# Altium schematic sheet schematic.SchDoc
size A4; SheetNumber: 6; SheetTotal: 29
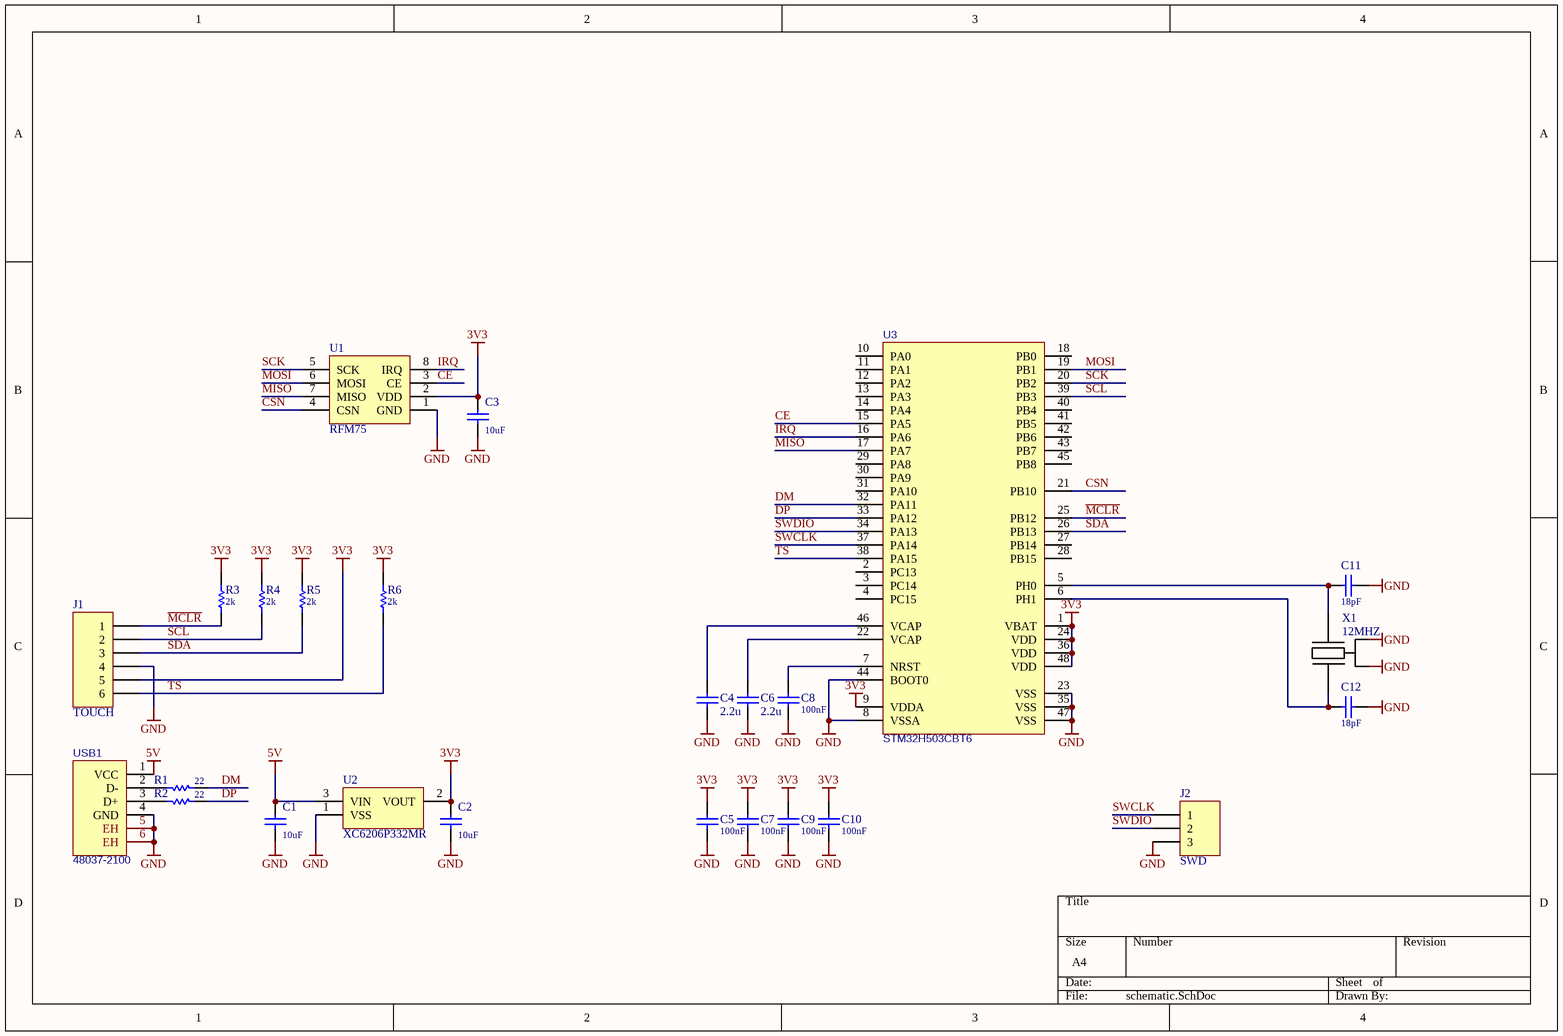
[diagram p0: schematic.SchDoc]

## Parts
C1  10uF  [C0805]
C2  10uF  [C0805]
C3  10uF  [C0805]
C4  2.2u  [C0603]
C5  100nF  [C0402]
C6  2.2u  [C0603]
C7  100nF  [C0402]
C8  100nF  [C0402]
C9  100nF  [C0402]
C10  100nF  [C0402]
C11  18pF  [C0402]
C12  18pF  [C0402]
J1  TOUCH  [HDR-1X6_2.54]  (no BOM)
J2  SWD  [HDR-1x3-P1.25]  (no BOM)
R1  22  [R0603]
R2  22  [R0603]
R3  2k  [R0603]
R4  2k  [R0603]
R5  2k  [R0603]
R6  2k  [R0603]
U1  RFM75  [RFM75]
U2  XC6206P332MR  [SOT-23]
U3  STM32H503CBT6  [LQFP-48]
USB1  48037-2100  [USB-A-TH_480372100]
X1  12MHZ  [CRYSTAL_2.5x2.0mm]

## Nets
3V3: C2.2 C3.2 C5.2 C7.2 C9.2 C10.2 J1.5 R3.2 R4.2 R5.2 R6.2 U1.2(VDD) U2.2(VOUT) U3.1(VBAT) U3.9(VDDA) U3.24(VDD) U3.36(VDD) U3.48(VDD)
5V: C1.2 U2.3(VIN) USB1.1(VCC)
GND: C1.1 C2.1 C3.1 C4.1 C5.1 C6.1 C7.1 C8.1 C9.1 C10.1 C11.1 C12.1 J1.4 J2.3 U1.1(GND) U2.1(VSS) U3.8(VSSA) U3.23(VSS) U3.35(VSS) U3.44(BOOT0) U3.47(VSS) USB1.4(GND) USB1.5(EH) USB1.6(EH) X1.2(GND) X1.4(GND)
CE: U1.3(CE) U3.15(PA5)
CSN: U1.4(CSN) U3.21(PB10)
DM: R1.2 U3.32(PA11)
DP: R2.2 U3.33(PA12)
IRQ: U1.8(IRQ) U3.16(PA6)
~{MCLR}: J1.1 R3.1 U3.25(PB12)
MISO: U1.7(MISO) U3.17(PA7)
MOSI: U1.6(MOSI) U3.19(PB1)
SCK: U1.5(SCK) U3.20(PB2)
SCL: J1.2 R4.1 U3.39(PB3)
SDA: J1.3 R5.1 U3.26(PB13)
SWCLK: J2.1 U3.37(PA14)
SWDIO: J2.2 U3.34(PA13)
~{TS}: J1.6 R6.1 U3.38(PA15)
NetC4_2: C4.2 U3.46(VCAP)
NetC6_2: C6.2 U3.22(VCAP)
NetC8_2: C8.2 U3.7(NRST)
NetC11_2: C11.2 U3.5(PH0) X1.3(X2)
NetC12_2: C12.2 U3.6(PH1) X1.1(X1)
NetR1_1: R1.1 USB1.2(D-)
NetR2_1: R2.1 USB1.3(D+)

Not connected (* = marked no-connect by the designer): U3 2(PC13) 3(PC14) 4(PC15) 10(PA0) 11(PA1) 12(PA2) 13(PA3) 14(PA4) 18(PB0) 27(PB14) 28(PB15) 29(PA8) 30(PA9) 31(PA10) 40(PB4) 41(PB5) 42(PB6) 43(PB7) 45(PB8)

## Library data of the parts
C1-C3 C5 C7-C10 = CAP
C4 C6 = Cap
C11 C12 = CAP: 18pF 50V 0402; P/N: GRM1555C1H180JA01D; LCSC part number: C33149
J1 J2 = Header 3
R1-R6 = RES
U2 = Component_4_1
X1 = CRYSTAL 12MHZ 3.20mm x 2.50mm: CRYSTAL 12MHZ 10PF SMD; P/N: TXM12M0004252FBCEO00T; LCSC part number: C284155
USB1 = 48037-2100: LCSC part number: C136453; P/N: 48037-2100